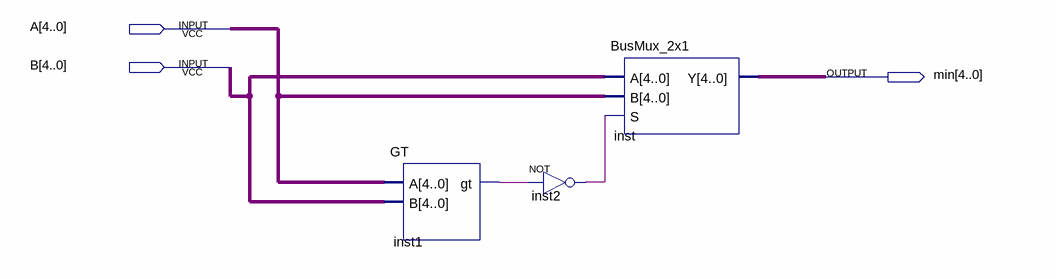
[diagram p0: schematic sheet]
// Quartus schematic Min_AB.bdf as structural Verilog: 3 symbols, 3 pins
module Min_AB (
  input  [4:0] A,
  input  [4:0] B,
  output [4:0] min
);

  wire inst1_gt, inst2_out;

  GT inst1 (.A(A), .B(B), .gt(inst1_gt));
  not inst2 (inst2_out, inst1_gt);
  BusMux_2x1 inst (.A(B), .B(A), .S(inst2_out), .Y(min));
endmodule
